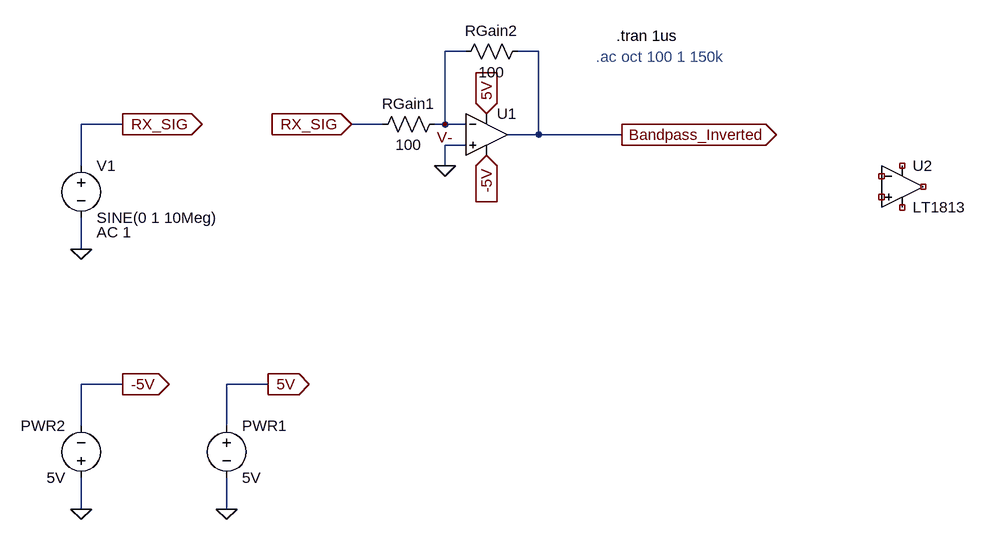
[diagram p0: schematic HighFreqOpAmp.asc]
HighFreqOpAmp.asc, the LTspice schematic file:
Version 4
SHEET 1 1176 1344
WIRE 400 624 368 624
WIRE 512 624 480 624
WIRE -128 736 -192 736
WIRE 272 736 224 736
WIRE 368 736 368 624
WIRE 368 736 352 736
WIRE 400 736 368 736
WIRE 512 752 512 624
WIRE 512 752 464 752
WIRE 640 752 512 752
WIRE 400 768 368 768
WIRE -192 800 -192 736
WIRE 368 800 368 768
WIRE -192 928 -192 880
WIRE -128 1136 -192 1136
WIRE 96 1136 32 1136
WIRE -192 1200 -192 1136
WIRE 32 1200 32 1136
WIRE -192 1328 -192 1280
WIRE 32 1328 32 1280
FLAG 432 720 5V
IOPIN 432 720 In
FLAG 432 784 -5V
IOPIN 432 784 In
FLAG 368 800 0
FLAG 640 752 Bandpass_Inverted
IOPIN 640 752 Out
FLAG 368 736 V-
FLAG 224 736 RX_SIG
IOPIN 224 736 In
FLAG -192 928 0
FLAG -128 736 RX_SIG
IOPIN -128 736 Out
FLAG 32 1328 0
FLAG 96 1136 5V
IOPIN 96 1136 Out
FLAG -192 1328 0
FLAG -128 1136 -5V
IOPIN -128 1136 Out
SYMBOL Res 368 720 R90
WINDOW 0 0 56 VBottom 2
WINDOW 3 32 56 VTop 2
SYMATTR InstName RGain1
SYMATTR Value 100
SYMBOL Res 496 608 R90
WINDOW 0 0 56 VBottom 2
WINDOW 3 32 56 VTop 2
SYMATTR InstName RGain2
SYMATTR Value 100
SYMBOL Voltage -192 784 R0
WINDOW 123 24 118 Left 2
SYMATTR Value2 AC 1
SYMATTR InstName V1
SYMATTR Value SINE(0 1 10Meg)
SYMBOL Voltage 32 1184 R0
SYMATTR InstName PWR1
SYMATTR Value 5V
SYMBOL Voltage -192 1296 R180
WINDOW 0 24 96 Left 2
WINDOW 3 24 16 Left 2
SYMATTR InstName PWR2
SYMATTR Value 5V
SYMBOL OpAmps/UniversalOpAmp 432 752 R0
SYMATTR InstName U1
SYMATTR Value2 Avol=1.4Meg GBW=50Meg Vos=0
SYMBOL OpAmps/LT1813 1072 768 R0
SYMATTR InstName U2
TEXT 632 600 Left 2 !.tran 1us
TEXT 600 632 Left 2 ;.ac oct 100 1 150k

The netlist it stands for:
* HighFreqOpAmp.asc
RGain1 V- RX_SIG 100
RGain2 Bandpass_Inverted V- 100
V1 RX_SIG 0 SINE(0 1 10Meg) AC 1
V§PWR1 5V 0 5V
V§PWR2 0 -5V 5V
XU1 0 V- 5V -5V Bandpass_Inverted level1 Avol=1.4Meg GBW=50Meg Vos=0 En=0 Enk=0 In=0 Ink=0 Rin=500Meg  ; pins In+ In- V+ V- OUT
XU2 NC_01 NC_02 NC_03 NC_04 NC_05 LT1813  ; pins In+ In- V+ V- OUT
.tran 1us
* .ac oct 100 1 150k
.lib UniversalOpAmp1.lib
.lib LTC.lib
.backanno
.end